# EAGLE design stepup (EAGLE 5.10)
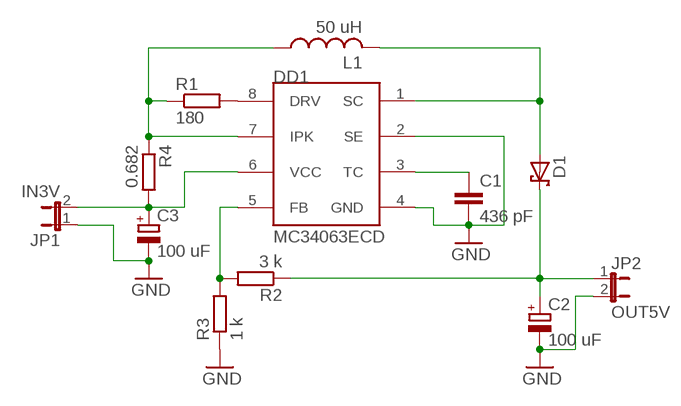
[diagram p0: schematic, sheet 1]

## Parts
C1  436 pF  C-EUC0805  [C0805]
C2  100 uF  CPOL-EUD/7343-31R  [D/7343-31R]
C3  100 uF  CPOL-EUD/7343-31R  [D/7343-31R]
D1  SCHOTTKY-DIODESMD  [SMB]
DD1  MC34063ECD  [SO8]
JP1  IN3V  JP1E  [JP1]
JP2  OUT5V  JP1E  [JP1]
L1  50 uH  L-USWE-TPC  [POWER-CHOKE_WE-TPC]
R1  180  R-EU_R0805  [R0805]
R2  3 k  R-EU_R0805  [R0805]
R3  1 k  R-EU_R0805  [R0805]
R4  0.682  R-EU_R0805  [R0805]

## Nets
GND: C1.2 C2.- C3.- DD1.2(SE) DD1.4(GND) JP1.1 JP2.2 R3.1
N$1: DD1.8(DRV) R1.2
N$2: DD1.7(IPK) L1.1 R1.1 R4.1
N$3: D1.A DD1.1(SC) L1.2
N$4: C1.1 DD1.3(TC)
N$5: C3.+ DD1.6(VCC) JP1.2 R4.2
N$6: C2.+ D1.C JP2.1 R2.1
N$8: DD1.5(FB) R2.2 R3.2

## Library data of the parts
C1 = rcl:C-EU: CAPACITOR, European symbol
C2 C3 = rcl:CPOL-EU: POLARIZED CAPACITOR, European symbol
D1 = diode:SCHOTTKY-DIODE: Schottky Diode
DD1 = power:MC34063ECD
JP1 JP2 = jumper:JP1E: JUMPER
L1 = rcl:L-US: INDUCTOR, American symbol
R1-R4 = rcl:R-EU_: RESISTOR, European symbol

## Board
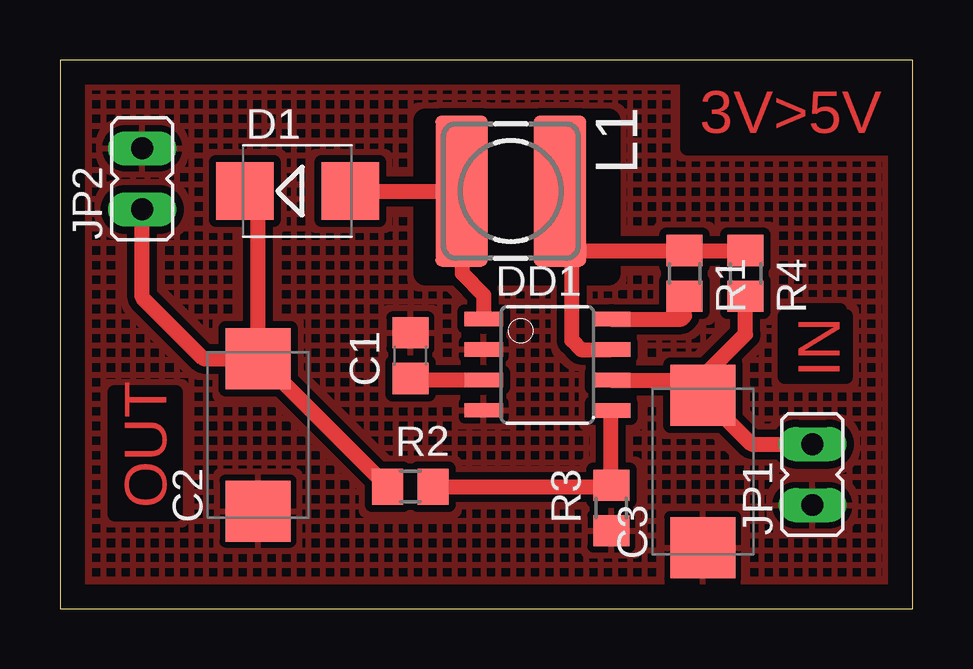
[diagram p1: board, top side]

Size 35.56 x 22.86 mm. Coordinates in mm from the lower left corner, seen from the top.
Outline: 0,0 35.56,0 35.56,22.86 0,22.86 0,0
Copper layers (1*16): Top 0.035mm / dielectric 1.5mm / Bottom 0.035mm
Design rules "default": minimum track width 10mil, minimum drill 24mil, track to track 8mil, track to pad 8mil, pad to pad 8mil, via to via 8mil, smd to smd 8mil, copper to edge 40mil, drill to drill 8mil, minimum pad ring 10mil, minimum via ring 8mil, stop-mask expansion 4mil, vias tented up to drill 0mil, thermal gap 10mil
tRestrict: area 15.2,14 to 22.9,20.3; area 2.3,3.9 to 4.8,9; area 30.2,9.7 to 32.8,12.2; area 26.2,19.2 to 34.7,22

### Footprints (pad centres in the part's own frame; a part is rotated, then mirrored left to right if it is on the bottom)
C0805 = smd 1.3 x 1.5: 1 -0.95,0; 2 0.95,0
D/7343-31R = smd 2.55 x 2.7: + 3.175,0; - -3.175,0
SMB = smd 2.4 x 2.4: A 2.2,0; C -2.2,0
SO8 = smd 0.6 x 1.6: 1 -1.905,-2.654; 2 -0.645,-2.654; 3 0.625,-2.654; 4 1.895,-2.654; 5 1.905,2.654; 6 0.635,2.654; 7 -0.635,2.654; 8 -1.905,2.654
JP1 = drill 0.914 long: 1 0,-1.27; 2 0,1.27
POWER-CHOKE_WE-TPC = smd 6.3 x 2.2: 1 0,2.05; 2 0,-2.05
R0805 = smd 1.3 x 1.5: 1 -0.95,0; 2 0.95,0

### Placement (x,y rotation side)
C1  14.61,10.54 90 top
C2  8.26,7.24 90 top
C3  26.8,5.71 90 top
D1  9.91,17.4 0 top
DD1  20.32,10.16 270 top
JP1  31.37,5.59 0 top
JP2  3.43,17.91 0 top
L1  18.8,17.4 270 top
R1  26.04,13.97 270 top
R2  14.61,5.08 0 top
R3  22.99,4.19 90 top
R4  28.57,13.97 270 top

### Tracks (layer width: path | path; a pad name or v marks a point on that pad's centre or on a via)
GND
  pour Top (isolate 0.305, hatched): 0,22.86 35.56,22.86 35.56,0 0,0
N$1
  Top 0.635: R1.2 26.04,12.19 25.91,12.06 DD1.8
N$2
  Top 0.635: R4.1 R1.1 21.4,14.92 21.34,14.99 | DD1.7 21.72,10.79 21.34,11.18 21.34,14.99 | 21.34,14.99 21.34,16.91 L1.1
N$3
  Top 0.635: DD1.1 17.67,13.07 16.76,13.97 16.76,17.38 L1.2 D1.A
N$4
  Top 0.635: DD1.3 14.66,9.54 C1.1
N$5
  Top 0.635: DD1.6 26.8,9.53 26.92,9.4 | 26.92,9.4 26.92,9.78 28.57,11.43 R4.2 | JP1.2 28.83,6.86 C3.+ 26.92,9.02 26.92,9.4
N$6
  Top 0.635: C2.+ 8.32,10.41 R2.1 | C2.+ 8.26,17.4 D1.C | JP2.1 3.43,12.95 5.97,10.41 C2.+
N$8
  Top 0.635: DD1.5 22.97,4.87 R3.2 22.93,5.08 R2.2

### Text on the board
Top: 3V>5V | IN | OUT